# Altium schematic sheet ARM TB V2 Schematic.SchDoc
size B
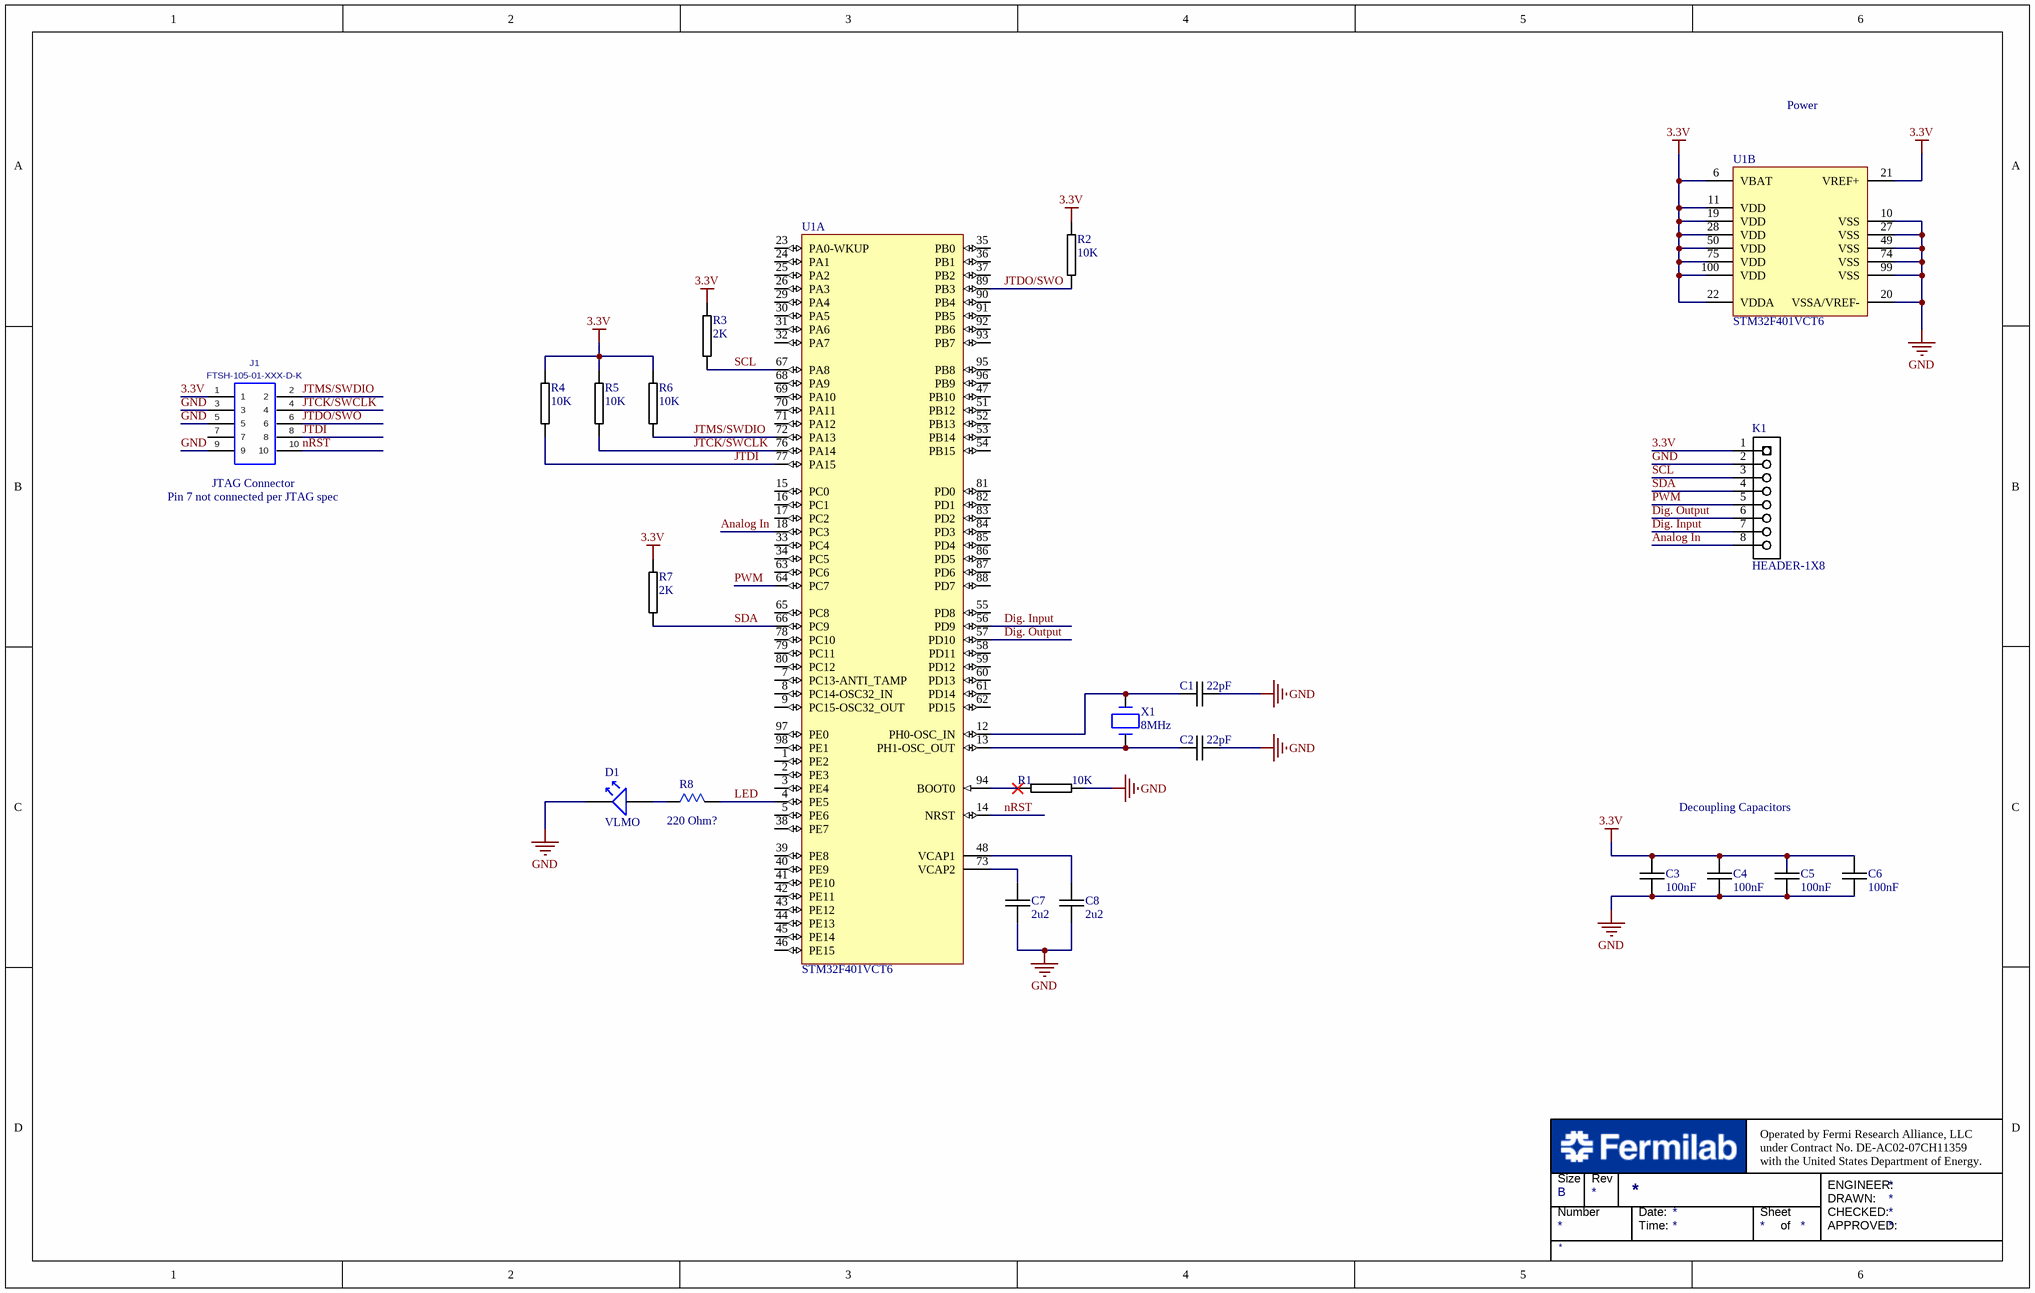
[diagram p0: ARM TB V2 Schematic.SchDoc]

## Parts
C1  22pF  [0603C-GENERIC]
C2  22pF  [0603C-GENERIC]
C3  100nF  [0603C-GENERIC]
C4  100nF  [0603C-GENERIC]
C5  100nF  [0603C-GENERIC]
C6  100nF  [0603C-GENERIC]
C7  2u2  [0603C-2U2]
C8  2u2  [0603C-2U2]
D1  VLMO  [VLMO]
J1  FTSH-105-01-XXX-D-K  [FTSH-105-01-XXX-D-K]
K1  HEADER-1X8  [HEADER-1X8]
R1  10K  [0603R-10K]
R2  10K  [0603R-10K]
R3  2K  [0603R-GENERIC]
R4  10K  [0603R-10K]
R5  10K  [0603R-10K]
R6  10K  [0603R-10K]
R7  2K  [0603R-GENERIC]
R8  ERJ-3GEY0R00V  [R0603-MED]  (value not drawn)
U1  STM32F401VCT6  [STM-LQFP100_N]  (parts A,B of 2)
X1  8MHz  [GCO800044]

## Nets
3.3V: C3.1 C4.1 C5.1 C6.1 J1.1 K1.1 R2.1 R3.1 R4.1 R5.1 R6.1 R7.1 U1.6(VBAT) U1.11(VDD) U1.19(VDD) U1.21(VREF+) U1.22(VDDA) U1.28(VDD) U1.50(VDD) U1.75(VDD) U1.100(VDD)
GND: C1.2 C2.2 C3.2 C4.2 C5.2 C6.2 C7.2 C8.2 D1.2 J1.3 J1.5 J1.9 K1.2 R1.2 U1.10(VSS) U1.20(VSSA/VREF-) U1.27(VSS) U1.49(VSS) U1.74(VSS) U1.99(VSS)
Analog In: K1.8 U1.18(PC3)
Dig. Input: K1.7 U1.56(PD9)
Dig. Output: K1.6 U1.57(PD10)
JTCK/SWCLK: J1.4 R5.2 U1.76(PA14)
JTDI: J1.8 R4.2 U1.77(PA15)
JTDO/SWO: J1.6 R2.2 U1.89(PB3)
JTMS/SWDIO: J1.2 R6.2 U1.72(PA13)
LED: R8.2 U1.4(PE5)
nRST: J1.10 U1.14(NRST)
PWM: K1.5 U1.64(PC7)
SCL: K1.3 R3.2 U1.67(PA8)
SDA: K1.4 R7.2 U1.66(PC9)
NetC1_1: C1.1 U1.12(PH0-OSC_IN) X1.1
NetC2_1: C2.1 U1.13(PH1-OSC_OUT) X1.2
NetC7_1: C7.1 U1.73(VCAP2)
NetC8_1: C8.1 U1.48(VCAP1)
NetD1_1: D1.1 R8.1
NetR1_1: R1.1 U1.94(BOOT0)

Not connected (* = marked no-connect by the designer): J1 7; U1 1(PE2) 2(PE3) 3(PE4) 5(PE6) 7(PC13-ANTI_TAMP) 8(PC14-OSC32_IN) 9(PC15-OSC32_OUT) 15(PC0) 16(PC1) 17(PC2) 23(PA0-WKUP) 24(PA1) 25(PA2) 26(PA3) 29(PA4) 30(PA5) 31(PA6) 32(PA7) 33(PC4) 34(PC5) 35(PB0) 36(PB1) 37(PB2) 38(PE7) 39(PE8) 40(PE9) 41(PE10) 42(PE11) 43(PE12) 44(PE13) 45(PE14) 46(PE15) 47(PB10) 51(PB12) 52(PB13) 53(PB14) 54(PB15) 55(PD8) 58(PD11) 59(PD12) 60(PD13) 61(PD14) 62(PD15) 63(PC6) 65(PC8) 68(PA9) 69(PA10) 70(PA11) 71(PA12) 78(PC10) 79(PC11) 80(PC12) 81(PD0) 82(PD1) 83(PD2) 84(PD3) 85(PD4) 86(PD5) 87(PD6) 88(PD7) 90(PB4) 91(PB5) 92(PB6) 93(PB7) 95(PB8) 96(PB9) 97(PE0) 98(PE1)

## Notes on the sheet
- Power
- (near J1) Pin 7 not connected per JTAG spec
- (near J1) JTAG Connector
- (near R8) 220 Ohm?
- Decoupling Capacitors
- Size
- Rev
- Operated by Fermi Research Alliance, LLC under Contract No. DE-AC02-07CH11359 with the United States Department of Energy.
- Number
- B
- Date:
- Time:
- Sheet
- of
- ENGINEER:
- DRAWN:
- CHECKED:
- APPROVED:

## Library data of the parts
C1 C2 = 0603C-22PF-50V-C0G-PAN: CAPACITOR 0603 CERAMIC; Manufacturer Part Number: ECJ-1VC1H220J; Manufacturer: Panasonic - ECG; Reel: C10; Tolerance: ±5%; Temperature Coefficient: C0G, NP0; Voltage - Rated: 50V; Supplier 1: Digi-Key; Features: General Purpose; Lead Spacing: -; Supplier: Digi-Key; Capacitance: 22pF; Packaging: Tape & Reel (TR); Mounting Type: Surface Mount, MLCC; RoHS: RoHS Compliant; Operating Temperature: -55°C ~ 125°C; Thickness: 0.80mm; Package / Case: 0603 (1608 metric); Category: Capacitors; Supplier Part Number 1: PCC220ACVTR-ND; Supplier Part Number: PCC220ACVTR-ND
C3-C6 = 0603C-100NF-25V-X7R-TDK: CAPACITOR 0603 CERAMIC; Manufacturer Part Number: C1608X7R1E104K; Manufacturer: TDK Corporation; Reel: C12; Supplier 1: Digi-Key; Supplier Part Number 1: 445-1316-2-ND
C7 C8 = 0603C-2U2-6V3-X5R-MUR: CAPACITOR 0603 CERAMIC; Reel: C20
D1 = VLMO: Vishay - VLMO31K1L2-GS08; Supplier 1: Digi-Key; Supplier Part Number 1: VLMO31K1L2-GS08CT-ND
J1 = FTSH-105-01-XXX-D-K: TERMINAL STRIP, .050"(1.27mm) PITCH, 10 PINS, KEYING OPTION.; MANUFACTURER: SAMTEC; CREATED: September 26, 2016 - Wendy Xin; PCB DECAL: FTSH-105-01-XXX-D-K
R1 R2 R4-R6 = 0603R-10K: GENERIC RESISTOR 0603; Manufacturer: Stackpole Electronics Inc; Manufacturer Part Number: RMCF 1/16 10K 1% R; Tolerance: ±1%; Power (Watts): 0.1W, 1/10W; Temperature Coefficient: ±100ppm/°C; Resistance In Ohms: 10.0K; Reel: R21; Category: Resistors; Supplier Part Number: RMCF1/1610KFRDKR-ND; Lead Style: Surface Mount (SMD - SMT); RoHS: RoHS Compliant; Packaging: Digi-Reel®; Case: 0603 (1608 metric); Composition: Thick Film; Supplier: Digi-Key; Supplier 1: Digi-Key; Supplier Part Number 1: RMCF0603FT10K0DKR-ND
R3 R7 = 0603R-2K: GENERIC RESISTOR 0603; Manufacturer Part Number: RMCF 1/16 2K 1% R; Manufacturer: Stackpole Electronics Inc; Temperature Coefficient: ±100ppm/°C; Power (Watts): 0.1W, 1/10W; Tolerance: ±1%; Resistance In Ohms: 2.00K; Reel: R9; Supplier 1: Digi-Key; Supplier Part Number 1: RMCF1/162KFRTR-ND; Supplier: Digi-Key; Supplier Part Number: RMCF1/162KFRTR-ND; RoHS: RoHS Compliant; Composition: Thick Film; Case: 0603 (1608 metric); Packaging: Tape & Reel (TR); Lead Style: Surface Mount (SMD - SMT); Category: Resistors
R8 = CMP-001-0038-1-1: RES SMD 0 OHM JUMPER 1/10W 0603; RevisionId: 1; Folder: Components\Resistors\0603\; ContentType: Component; Power: 100mW; Value: 0; AncestorItemRevisionGUID: https://www.digikey.com/product-detail/en/panasonic-electronic-components/ERJ-3GEY0R00V/P0.0GTR-ND/135656; ReleaseDate: 10/07/2017 10:09:55 PM; ComponentType: Resistor; Case/Package: 0603; Mount: SMD; Pins: 2
U1 = STM32F401VCT6: ARM Cortex-M4 32-bit MCU+FPU, 105 DMIPS, 256 kB Flash, 64 kB Internal RAM, 79 I/Os, 100-pin LQFP, -40 to 85 degC, Tray; Manufacturer: STMicroelectronics; FLASH Size (Prog) (kB): 256; I/Os (High Current): 79; Internal RAM Size (kB): 64; Operating Frequency(F) (Processor speed) (MHz): 84; Supply Voltage(Vcc) max (V): 3.6; Supply Voltage(Vcc) min (V): 1.8; DatasheetVersion: Rev. 1; PackageVersion: Rev. 1, 06/2013; PackageReference: LQFP100; PackageDescription: 100-Pin Low Profile Quad Flat Package, 14 x 14 mm Body, 0.5 mm Pitch; Supplier 1: Digi-Key; Supplier Part Number 1: 497-14048-ND; Supplier 2: Newark; Supplier Part Number 2: 19X6223; Supplier 3: Mouser; Supplier Part Number 3: 511-STM32F401VCT6; Core: ARM Cortex-M4; Packing: Tray; Mounting Technology: Surface Mount; PartNumber: STM32F401VCT6; ComponentLink1Description: Manufacturer URL; ComponentLink1URL: http://www.st.com/web/en/home.html; ComponentLink2Description: Datasheet; ComponentLink2URL: http://www.st.com/st-web-ui/static/active/en/resource/technical/document/data_brief/DM00071938.pdf; ComponentLink3Description: Package Specification; ComponentLink3URL: http://www.st.com/st-web-ui/static/active/en/resource/technical/document/data_brief/DM00071938.pdf
X1 = GC0800044: Diodes Incorporated GC0800044; Supplier 1: Digi-Key; Supplier Part Number 1: GC0800044TR-ND
K1 = HEADER-1X8: Supplier 1: Digi-Key; Supplier Part Number 1: S1011E-36-ND